# EAGLE design Laser_Array_Temp_High_BRD_V1.1sch (EAGLE 7.7.0)
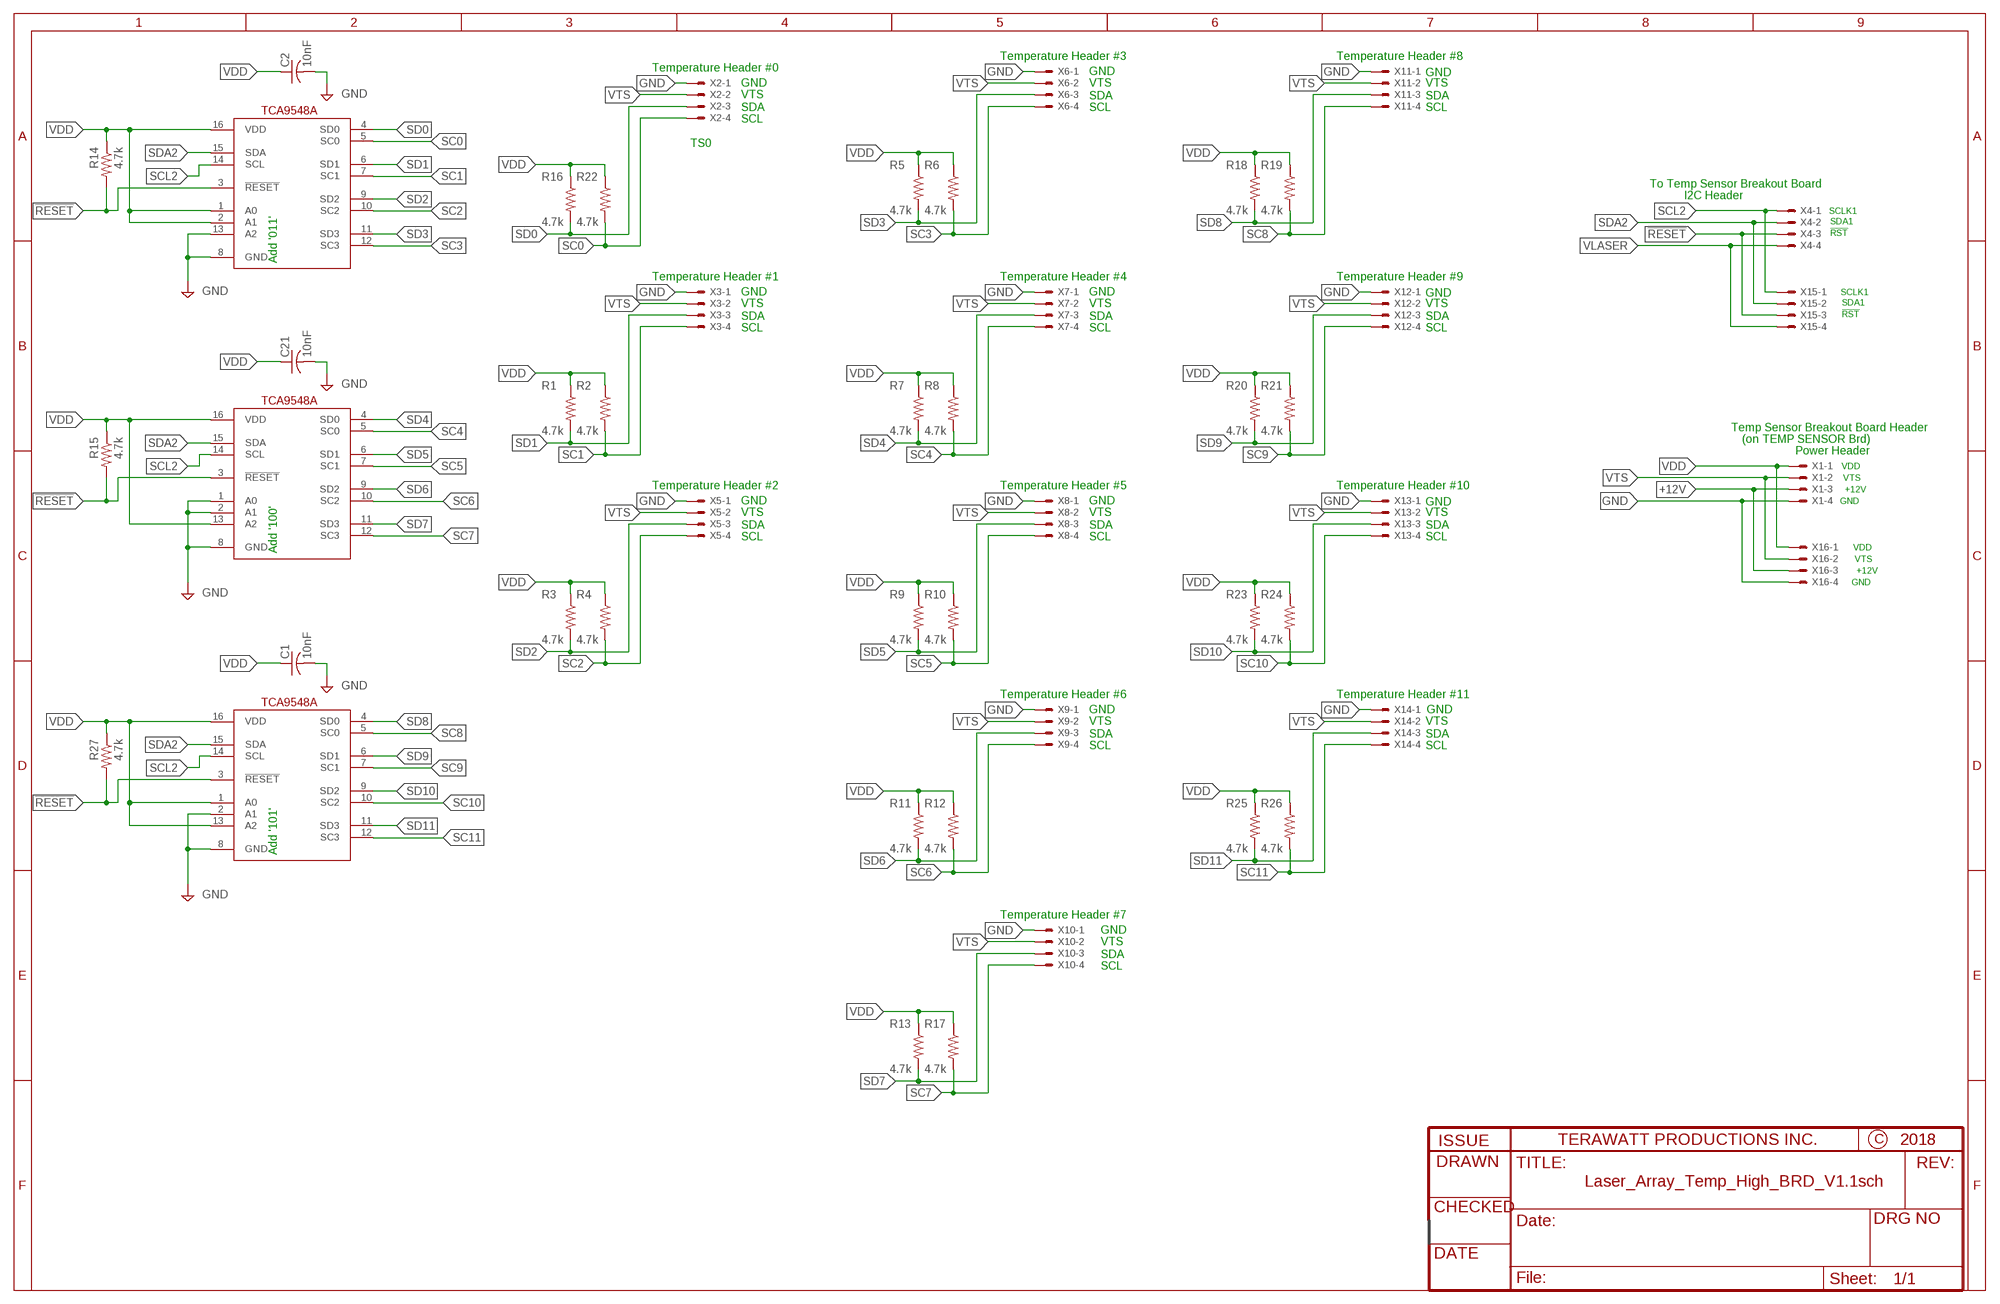
[diagram p0: schematic, sheet 1]

## Parts
C1  10nF  C-USC0805  [C0805]
C2  10nF  C-USC0805  [C0805]
C21  10nF  C-USC0805  [C0805]
R1  4.7k  R-US_M0805  [M0805]
R2  4.7k  R-US_M0805  [M0805]
R3  4.7k  R-US_M0805  [M0805]
R4  4.7k  R-US_M0805  [M0805]
R5  4.7k  R-US_M0805  [M0805]
R6  4.7k  R-US_M0805  [M0805]
R7  4.7k  R-US_M0805  [M0805]
R8  4.7k  R-US_M0805  [M0805]
R9  4.7k  R-US_M0805  [M0805]
R10  4.7k  R-US_M0805  [M0805]
R11  4.7k  R-US_M0805  [M0805]
R12  4.7k  R-US_M0805  [M0805]
R13  4.7k  R-US_M0805  [M0805]
R14  4.7k  R-US_M0805  [M0805]
R15  4.7k  R-US_M0805  [M0805]
R16  4.7k  R-US_M0805  [M0805]
R17  4.7k  R-US_M0805  [M0805]
R18  4.7k  R-US_M0805  [M0805]
R19  4.7k  R-US_M0805  [M0805]
R20  4.7k  R-US_M0805  [M0805]
R21  4.7k  R-US_M0805  [M0805]
R22  4.7k  R-US_M0805  [M0805]
R23  4.7k  R-US_M0805  [M0805]
R24  4.7k  R-US_M0805  [M0805]
R25  4.7k  R-US_M0805  [M0805]
R26  4.7k  R-US_M0805  [M0805]
R27  4.7k  R-US_M0805  [M0805]
U1  TCA9546A  [SOIC16N]
U2  TCA9546A  [SOIC16N]
U3  TCA9546A  [SOIC16N]
X1  22-23-2041  [22-23-2041]
X2  22-23-2041  [22-23-2041]
X3  22-23-2041  [22-23-2041]
X4  22-23-2041  [22-23-2041]
X5  22-23-2041  [22-23-2041]
X6  22-23-2041  [22-23-2041]
X7  22-23-2041  [22-23-2041]
X8  22-23-2041  [22-23-2041]
X9  22-23-2041  [22-23-2041]
X10  22-23-2041  [22-23-2041]
X11  22-23-2041  [22-23-2041]
X12  22-23-2041  [22-23-2041]
X13  22-23-2041  [22-23-2041]
X14  22-23-2041  [22-23-2041]
X15  22-23-2041  [22-23-2041]
X16  22-23-2041  [22-23-2041]

## Nets
!RESET: R14.2 R15.2 R27.2 U1.3(!RESET) U2.3(!RESET) U3.3(!RESET) X4.3 X15.3
+12V: X1.3 X16.3
GND: C1.2 C2.2 C21.2 U1.8(GND) U1.13(A2) U2.1(A0) U2.2(A1) U2.8(GND) U3.2(A1) U3.8(GND) X1.4 X2.1 X3.1 X5.1 X6.1 X7.1 X8.1 X9.1 X10.1 X11.1 X12.1 X13.1 X14.1 X16.4
SC0: R22.2 U1.5(SC0) X2.4
SC1: R2.2 U1.7(SC1) X3.4
SC2: R4.2 U1.10(SC2) X5.4
SC3: R6.2 U1.12(SC3) X6.4
SC4: R8.2 U2.5(SC0) X7.4
SC5: R10.2 U2.7(SC1) X8.4
SC6: R12.2 U2.10(SC2) X9.4
SC7: R17.2 U2.12(SC3) X10.4
SC8: R19.2 U3.5(SC0) X11.4
SC9: R21.2 U3.7(SC1) X12.4
SC10: R24.2 U3.10(SC2) X13.4
SC11: R26.2 U3.12(SC3) X14.4
SCL2: U1.14(SCL) U2.14(SCL) U3.14(SCL) X4.1 X15.1
SD0: R16.2 U1.4(SD0) X2.3
SD1: R1.2 U1.6(SD1) X3.3
SD2: R3.2 U1.9(SD2) X5.3
SD3: R5.2 U1.11(SD3) X6.3
SD4: R7.2 U2.4(SD0) X7.3
SD5: R9.2 U2.6(SD1) X8.3
SD6: R11.2 U2.9(SD2) X9.3
SD7: R13.2 U2.11(SD3) X10.3
SD8: R18.2 U3.4(SD0) X11.3
SD9: R20.2 U3.6(SD1) X12.3
SD10: R23.2 U3.9(SD2) X13.3
SD11: R25.2 U3.11(SD3) X14.3
SDA2: U1.15(SDA) U2.15(SDA) U3.15(SDA) X4.2 X15.2
VDD: C1.1 C2.1 C21.1 R1.1 R2.1 R3.1 R4.1 R5.1 R6.1 R7.1 R8.1 R9.1 R10.1 R11.1 R12.1 R13.1 R14.1 R15.1 R16.1 R17.1 R18.1 R19.1 R20.1 R21.1 R22.1 R23.1 R24.1 R25.1 R26.1 R27.1 U1.1(A0) U1.2(A1) U1.16(VDD) U2.13(A2) U2.16(VDD) U3.1(A0) U3.13(A2) U3.16(VDD) X1.1 X16.1
VLASER: X4.4 X15.4
VTS: X1.2 X2.2 X3.2 X5.2 X6.2 X7.2 X8.2 X9.2 X10.2 X11.2 X12.2 X13.2 X14.2 X16.2

## Notes on the sheet
- Temperature Header #3 | Temperature Header #8
- Temperature Header #0
- GND | GND
- GND | VTS | VTS
- VTS | SDA | SDA
- SDA | SCL | SCL
- SCL
- TS0
- To Temp Sensor Breakout Board
- I2C Header
- SCLK1
- SDA1
- !RST
- Add '011'
- Temperature Header #1 | Temperature Header #4 | Temperature Header #9
- GND | GND | GND | SCLK1
- VTS | VTS | VTS | SDA1
- SDA | SDA | SDA | !RST
- SCL | SCL | SCL
- Temp Sensor Breakout Board Header
- (on TEMP SENSOR Brd)
- Power Header
- VDD
- VTS
- Temperature Header #2 | Temperature Header #5 | Temperature Header #10
- +12V
- GND | GND | GND | GND
- VTS | VTS | VTS
- SDA | SDA | SDA
- SCL | SCL | SCL
- Add '100' | VDD
- VTS
- +12V
- GND
- Temperature Header #6 | Temperature Header #11
- GND | GND
- VTS | VTS
- SDA | SDA
- SCL | SCL
- Add '101'
- Temperature Header #7
- GND
- VTS
- SDA
- SCL

## Library data of the parts
C1 C2 C21 = rcl:C-US: CAPACITOR, American symbol
R1-R27 = rcl:R-US_: RESISTOR, American symbol
U1-U3 = Mine:TCA9546A
X1-X16 = Mine:22-23-2041: .100" (2.54mm) Center Header - 4 Pin; MF: MOLEX; MPN: 22-23-2041; OC_FARNELL: 1462920; OC_NEWARK: 38C0355

## Net classes
0 default: width 0.254 mm, drill 0.508 mm, clearance 0.203 mm

## Board
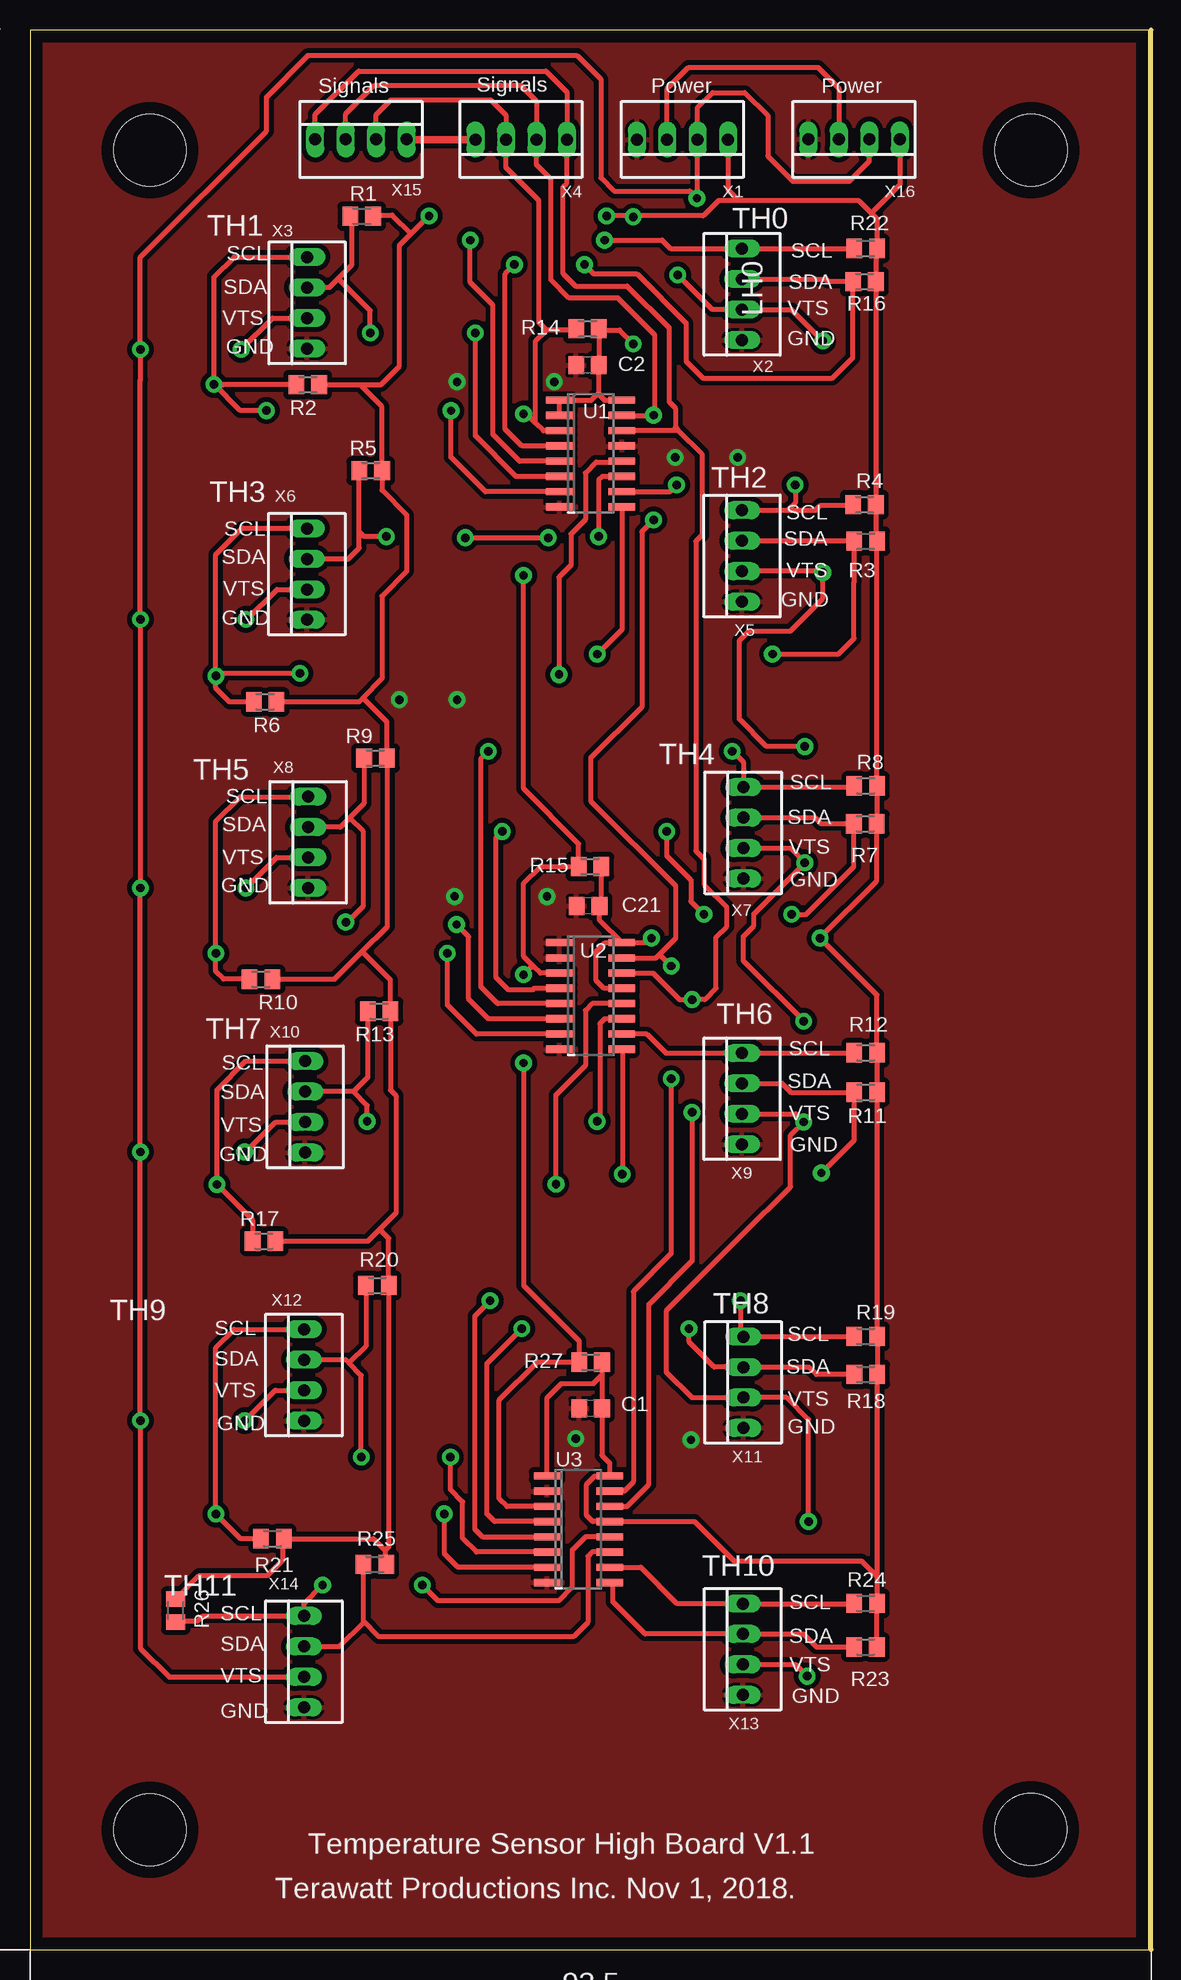
[diagram p1: board, top side]
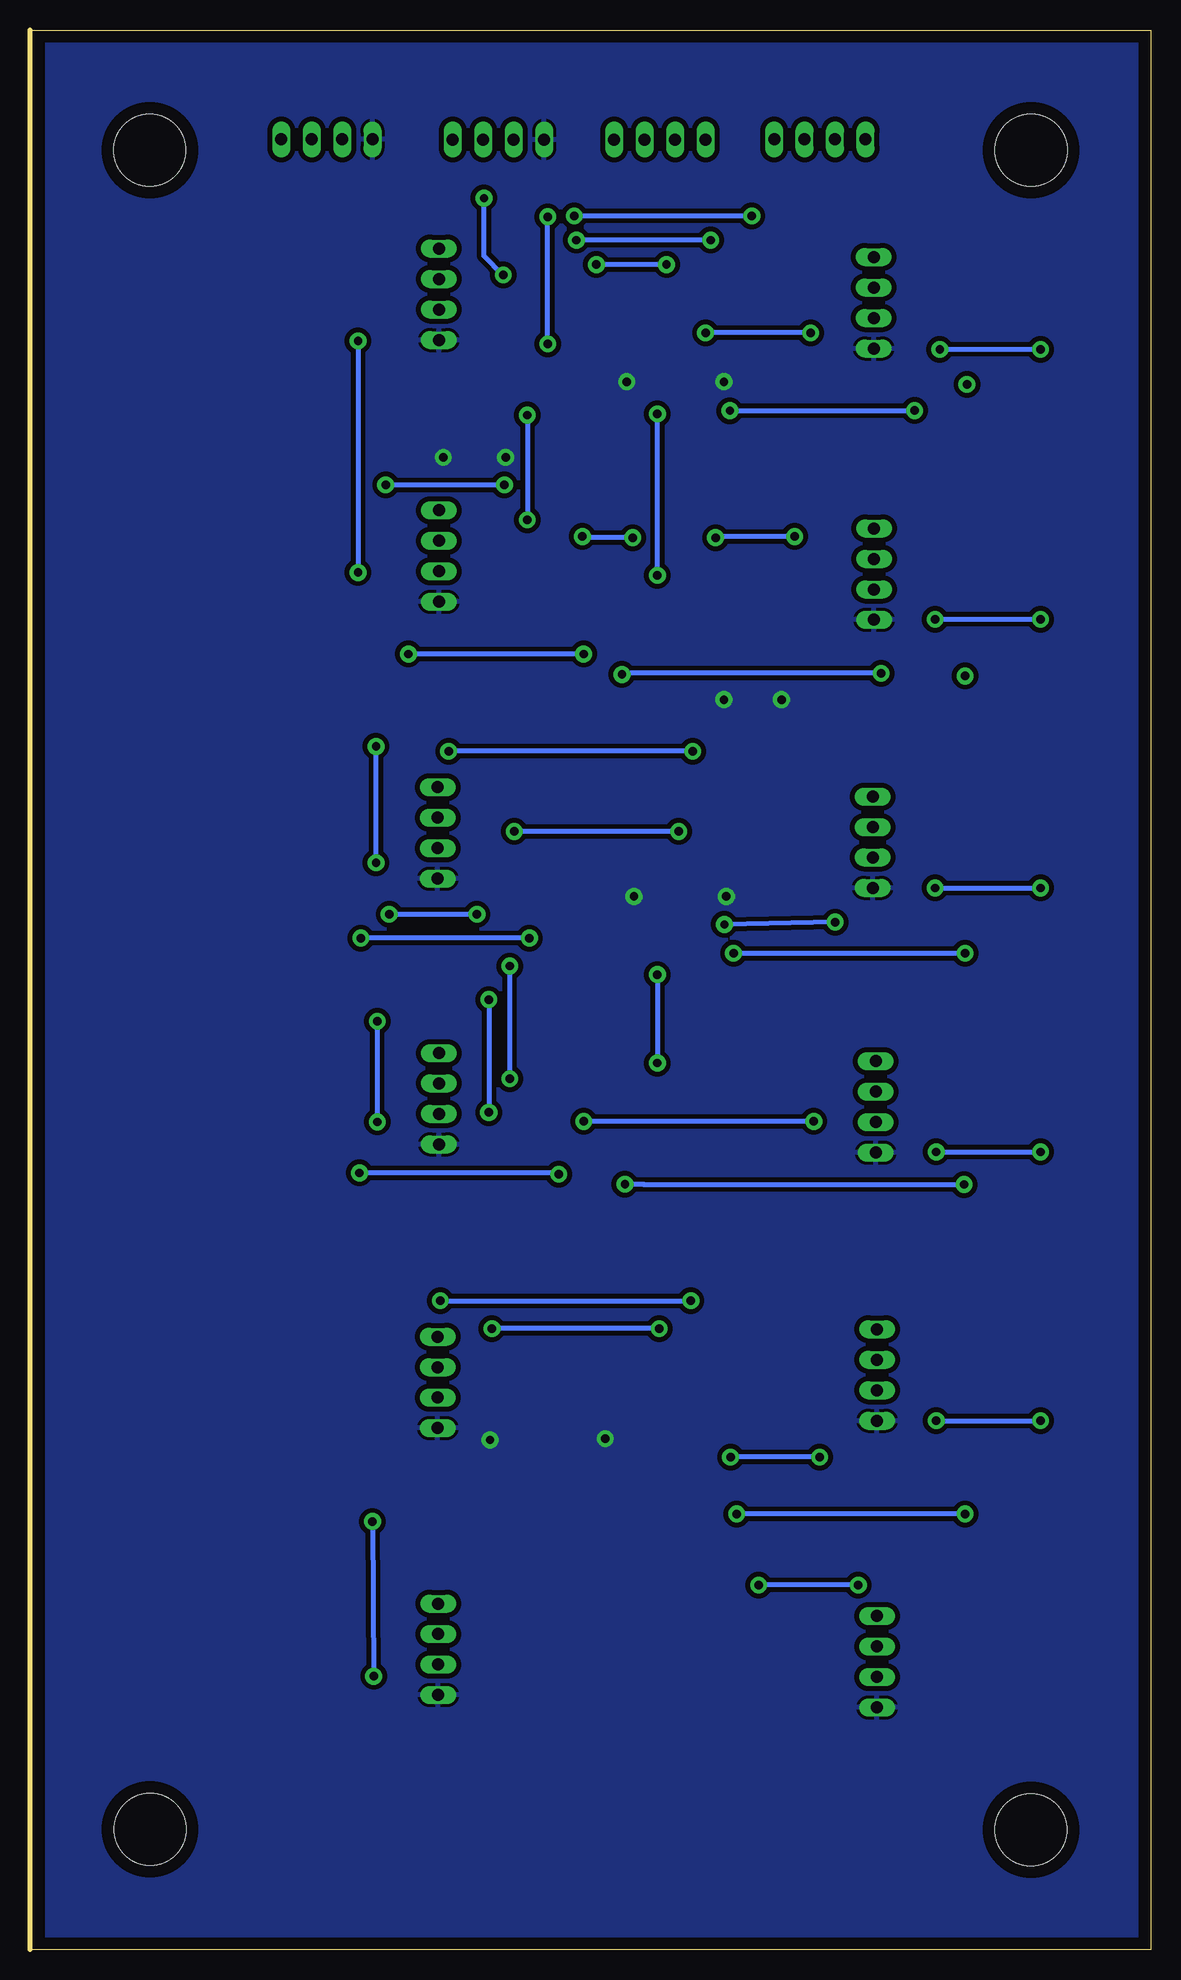
[diagram p2: board, bottom side, seen from below]

Size 93.45 x 160.02 mm. Coordinates in mm from the lower left corner, seen from the top.
Outline: 0,0 93.45,0 93.45,160.02 0,160.02 0,0
Copper layers (1*16): Top 0.035mm / dielectric 1.5mm / Bottom 0.035mm
Design rules "default *": minimum track width 10mil, minimum drill 24mil, track to track 16mil, track to pad 14mil, pad to pad 14mil, via to via 14mil, smd to smd 14mil, copper to edge 40mil, drill to drill 8mil, minimum pad ring 10mil, minimum via ring 8mil, stop-mask expansion 4mil, vias tented up to drill 0mil, thermal gap 10mil
Holes 5.99 mm at 10,10 83.44,10.04 83.46,150
Holes 6 mm at 10,150

### Footprints (pad centres in the part's own frame; a part is rotated, then mirrored left to right if it is on the bottom)
C0805 = smd 1.3 x 1.5: 1 -0.95,0; 2 0.95,0
M0805 = smd 1.3 x 1.6: 1 -0.95,0; 2 0.95,0
SOIC16N = smd 0.6 x 2.2: 1 -4.445,-2.6; 2 -3.175,-2.6; 3 -1.905,-2.6; 4 -0.635,-2.6; 5 0.635,-2.6; 6 1.905,-2.6; 7 3.175,-2.6; 8 4.445,-2.6; 9 4.445,2.6; 10 3.175,2.6; 11 1.905,2.6; 12 0.635,2.6; 13 -0.635,2.6; 14 -1.905,2.6; 15 -3.175,2.6; 16 -4.445,2.6
22-23-2041 = drill 1 long: 1 -3.81,0; 2 -1.27,0; 3 1.27,0; 4 3.81,0

### Placement (x,y rotation side)
C1  46.74,45.13 180 top
C2  46.48,132.08 180 top
C21  46.53,86.99 180 top
R1  27.65,144.51 180 top
R2  23.15,130.46 180 top
R3  69.67,117.41 180 top
R4  69.57,120.46 180 top
R5  28.4,123.28 180 top
R6  19.61,104.01 180 top
R7  69.64,93.86 180 top
R8  69.67,97.02 180 top
R9  28.8,99.33 180 top
R10  19.26,80.9 180 top
R11  69.67,71.47 180 top
R12  69.67,74.77 180 top
R13  29.1,78.23 180 top
R14  46.48,135.13 180 top
R15  46.69,90.3 180 top
R16  69.57,139.04 180 top
R17  19.51,59.06 180 top
R18  69.68,47.95 180 top
R19  69.67,51.12 180 top
R20  28.95,55.38 180 top
R21  20.21,34.26 180 top
R22  69.67,141.81 180 top
R23  69.65,25.23 180 top
R24  69.67,28.87 180 top
R25  28.74,32.13 180 top
R26  12.14,28.27 270 top
R27  46.74,48.98 180 top
U1  46.74,124.71 270 top
U2  46.74,79.5 270 top
U3  45.72,35.05 270 top
X1  54.39,150.89 180 top
X2  59.36,137.98 90 top
X3  23.11,137.29 90 top
X4  40.94,150.89 180 top
X5  59.36,116.18 90 top
X6  23.09,114.66 90 top
X7  59.46,93.09 90 top
X8  23.19,92.31 90 top
X9  59.36,70.94 90 top
X10  22.94,70.26 90 top
X11  59.46,47.29 90 top
X12  22.83,47.91 90 top
X13  59.42,25.04 90 top
X14  22.83,24.01 90 top
X15  27.6,150.9 0 top
X16  68.7,150.9 180 top

### Tracks (layer width: path | path; a pad name or v marks a point on that pad's centre or on a via)
!RESET  (via drill 0.7 pad 1.4)
  Top 0.406: U1.3 42.8,126.62 42.16,127.25 | 42.16,127.25 42.16,134.11 43.05,135 | R14.2 45.41,135 43.05,135 | 42.16,127.25 41.4,128.02 v41.15,128.02 | 43.05,135 42.42,135.64 42.42,145.8 39.67,148.54 39.67,150.1 X4.3 39.67,152.93 38.4,154.2 30.1,154.2 28.87,152.97 X15.3 | U2.3 42.55,81.41 42.04,81.92 | 42.04,81.92 41.15,82.8 41.15,88.9 42.55,90.3 R15.2 45.74,92.18 41.15,96.77 v41.15,114.56 | v41.15,73.91 41.15,55.37 45.79,50.73 R27.2 45.77,49 42.3,49 39.12,45.82 39.12,37.59 39.75,36.96 U3.3 | v41.15,81.28 41.78,81.92 42.04,81.92
  Bottom 0.406: v41.15,114.56 v41.15,128.02 | v41.15,81.28 v41.15,73.91
+12V
  Top 0.406: X1.3 53.12,155.12 54.9,156.9 65.7,156.9 67.43,155.17 X16.3
GND  (via drill 0.7 pad 1.4)
  other vias: 30.8,104.2 35.6,104.2 35.6,130.7 43.7,130.7 35.4,87.8 43.1,87.8 53.8,124.4 59,124.4 45.5,42.6 55.1,42.5
  pour Top: 0,160.1 93.47,159.84 93.47,-0.25 0,0
  pour Bottom: 0,160.1 94.23,159.84 94.23,-0.25 0.25,0
SC0  (via drill 0.7 pad 1.4)
  Top 0.406: U1.5 40.82,124.08 38.6,126.3 38.6,137.1 36.7,139 v36.7,142.5 | R22.2 64.82,141.81 64.8,141.79 X2.4 53.41,141.79 52.7,142.5 v47.9,142.5
  Bottom 0.406: v36.7,142.5 v47.9,142.5
SC1  (via drill 0.7 pad 1.4)
  Top 0.406: U1.7 37.97,121.54 35.1,124.41 v35.1,128.29 | X3.4 17,141.1 15.34,139.44 v15.34,130.49 | R2.2 16.07,130.46 v15.34,130.49 | v19.7,128.3 17.53,128.3 v15.34,130.49
  Bottom 0.406: v35.1,128.29 19.71,128.29 v19.7,128.3
SC2  (via drill 0.7 pad 1.4)
  Top 0.406: X5.4 63.2,119.99 | 63.2,119.99 65.49,119.99 65.9,120.4 68.56,120.4 R4.2 | U1.10 53.34,121.54 v53.9,122.1 | v63.8,122.1 63.8,120.59 63.2,119.99
  Bottom 0.406: v53.9,122.1 v63.8,122.1
SC3  (via drill 0.7 pad 1.4)
  Top 0.406: R6.2 16.64,104.01 15.49,105.16 v15.49,106.17 15.49,106.43 | 15.49,106.43 15.49,116.29 17.7,118.5 23.06,118.5 X6.4 | 15.49,106.43 22.47,106.43 v22.5,106.4 | U1.12 49.26,124 47.2,124 46.3,123.1 46.3,119.2 45.1,118 45.1,115.4 44.1,114.4 v44.1,106.3
  Bottom 0.406: v22.5,106.4 44,106.4 v44.1,106.3
SC4  (via drill 0.7 pad 1.4)
  Top 0.406: U2.5 38.99,78.87 37.59,80.26 37.59,99.28 v38.21,99.9 | R8.2 68.6,96.9 X7.4 59.47,98.98 v58.55,99.9
  Bottom 0.406: v38.21,99.9 v58.55,99.9
SC5  (via drill 0.7 pad 1.4)
  Top 0.406: U2.7 37.21,76.33 34.8,78.74 v34.8,83.06 | R10.2 16.13,80.9 15.49,81.53 v15.49,83.06 15.49,94.09 17.5,96.1 23.17,96.1 X8.4
  Bottom 0.406: v15.49,83.06 v34.8,83.06
SC6
  Top 0.406: U2.10 51.43,76.33 53.01,74.75 X9.4 59.38,74.77 R12.2
SC7  (via drill 0.7 pad 1.4)
  Top 0.406: X10.4 17.97,74.07 15.59,71.69 v15.59,63.79 18.56,60.81 R17.2 | U2.12 46.87,78.87 46.3,78.3 46.3,73.7 43.85,71.25 v43.85,63.81
  Bottom 0.406: 42.29,63.79 42.3,63.8 | 42.29,63.79 43.83,63.79 v43.85,63.81 | 42.29,63.79 v15.59,63.79
SC8  (via drill 0.7 pad 1.4)
  Top 0.406: U3.5 37.72,34.42 37.08,35.05 37.08,52.83 v38.35,54.1 | R19.2 68.7,51.1 X11.4 59.24,51.33 v59.24,54.1
  Bottom 0.406: v59.24,54.1 v38.35,54.1
SC9  (via drill 0.7 pad 1.4)
  Top 0.406: U3.7 35.69,31.88 34.54,33.02 v34.54,36.32 | R21.2 17.55,34.26 v15.49,36.32 15.49,50.19 17.02,51.72 X12.4
  Bottom 0.406: v15.49,36.32 v34.54,36.32
SC10
  Top 0.406: U3.10 50.93,31.88 53.95,28.85 X13.4 68.7,28.85 R24.2
SC11  (via drill 0.7 pad 1.4)
  Top 0.406: U3.12 46.32,34.42 45.2,33.3 45.2,30.2 44.1,29.1 34,29.1 v32.7,30.4 | v24.4,30.4 22.83,28.83 X14.4 14.41,27.82 14.02,27.43 12.25,27.43 R26.2
  Bottom 0.406: v24.4,30.4 v32.7,30.4
SCL2  (via drill 0.7 pad 1.4, 0.7 pad 1.42)
  Top 0.406: 54.08,126.62 U1.14 | U2.14 51.94,81.41 54.15,79.2 v55.2,79.2 56.25,79.2 57.2,80.15 57.2,84.4 58.1,85.3 58.1,86.9 56.2,88.8 56.2,90.9 55.5,91.6 55.5,117.4 56,117.9 56,124.7 54.08,126.62 | 54.08,126.62 53.8,126.9 53.8,128.5 53.3,129 53.3,135.17 49.78,138.68 45.47,138.68 44.45,139.7 44.45,146.95 44.75,147.25 X4.1 44.75,154.85 43,156.6 27.4,156.6 23.79,152.99 X15.1 | U3.14 49.76,36.96 51.6,38.8 51.6,53.8 55.2,57.4 v55.2,69.8
  Bottom 0.406: v55.2,79.2 v55.2,69.8
SD0  (via drill 0.7 pad 1.4)
  Top 0.406: U1.4 41.02,125.35 39.62,126.75 39.62,139.7 v40.39,140.46 | v46.23,140.46 46.99,139.7 50.6,139.7 54.7,135.6 54.7,132.4 56.1,131 66.9,131 68.6,132.7 68.6,139.02 R16.2 68.57,139.1 66.5,139.1 66.35,139.25 X2.3
  Bottom 0.406: v40.39,140.46 v46.23,140.46
SD1  (via drill 0.7 pad 1.4)
  Top 0.406: U1.6 40.51,122.81 37.13,126.19 v37.13,134.77 | 23.05,138.5 X3.3 | R1.2 26.8,144.41 26.8,140.4 25.7,139.3 | 25.7,139.3 24.96,138.56 X3.3 | 23.06,138.6 X3.3 | 25.7,139.3 28.37,136.63 v28.37,134.77
  Bottom 0.406: v28.37,134.77 v37.13,134.77
SD2  (via drill 0.7 pad 1.4)
  Top 0.406: X5.3 68.68,117.45 R3.2 68.72,114.03 68.7,114 68.7,109.3 67.4,108 v61.9,108 | U1.9 49.34,110.04 v47.3,108
  Bottom 0.406: v47.3,108 v61.9,108
SD3  (via drill 0.7 pad 1.4)
  Top 0.406: X6.3 23.12,115.9 26.5,115.9 27.45,116.85 27.45,118.2 | U1.11 47.71,122.81 47.4,122.5 v47.4,117.8 | 27.45,118.2 R5.2 | v29.7,117.8 27.85,117.8 27.45,118.2 | v36.3,117.7 v43.2,117.7
  Bottom 0.406: v29.7,117.8 36.2,117.8 v36.3,117.7 | v43.2,117.7 47.3,117.7 v47.4,117.8
SD4  (via drill 0.7 pad 1.4)
  Top 0.406: U2.4 42.04,80.14 41.91,80.01 39.88,80.01 38.86,81.03 38.86,92.71 v39.37,93.22 | v53.09,93.22 53.09,91.19 55.12,89.15 55.1,89.14 55.1,87.39 v56.19,86.3 | X7.3 65.44,94.36 65.94,93.86 R7.2 68.69,90.29 64.7,86.3 v63.5,86.3
  Bottom 0.406: v39.37,93.22 v53.09,93.22 | v56.19,86.3 v63.5,86.3
SD5  (via drill 0.7 pad 1.4)
  Top 0.406: U2.6 38.23,77.6 36.58,79.25 36.58,84.44 v35.56,85.46 | R9.2 27.85,95.55 26.65,94.35 | 26.65,94.35 25.88,93.58 X8.3 | v26.32,85.66 26.26,85.46 27.8,87 27.8,93.2 26.65,94.35
  Bottom 0.406: v26.32,85.66 v35.56,85.46
SD6  (via drill 0.7 pad 1.4)
  Top 0.406: X9.3 62.69,72.21 63.42,71.47 R11.2 68.72,67.49 v65.98,64.75 | U2.9 49.38,75.02 v49.38,64.65
  Bottom 0.406: v49.38,64.65 49.48,64.75 v65.98,64.75
SD7  (via drill 0.7 pad 1.4)
  Top 0.406: 26.97,71.53 28.11,70.39 v28.11,69.05 | 26.97,71.53 X10.3 | R13.2 28.15,72.71 26.97,71.53 | U2.11 47.9,77.6 47.5,77.2 47.5,69.27 v47.28,69.05
  Bottom 0.406: v28.11,69.05 v47.28,69.05
SD8  (via drill 0.7 pad 1.4)
  Top 0.406: U3.4 38.73,35.69 38.1,36.32 38.1,48.87 v41,51.78 | R18.2 65.55,47.95 64.94,48.56 X11.3 59.45,48.58 57.04,48.58 54.94,50.68 v54.94,51.78
  Bottom 0.406: v41,51.78 v54.94,51.78
SD9  (via drill 0.7 pad 1.4)
  Top 0.406: U3.6 37.21,33.15 36.07,34.29 36.07,37.34 35.05,38.35 v35.05,41.06 | v27.62,41.06 27.62,47.88 26.6,48.9 | 26.6,48.9 26.32,49.18 X12.3 | R20.2 28,50.3 26.6,48.9
  Bottom 0.406: v27.62,41.06 v35.05,41.06
SD10
  Top 0.406: U3.9 48.6,30.33 48.6,29 51.29,26.31 X13.3 64.49,26.31 65.57,25.23 R23.2
SD11
  Top 0.406: X14.3 25.78,25.28 27.79,27.29 27.79,27.4 | 27.79,27.4 R25.2 | U3.11 46.85,33.15 46.5,32.8 46.5,27.3 45.3,26.1 29.09,26.1 27.79,27.4
SDA2  (via drill 0.7 pad 1.4)
  Top 0.406: U3.15 49.53,38.23 50.29,38.99 50.29,54.86 53.46,58.03 v53.46,72.6 | U1.15 51.96,127.89 v51.99,127.92 52.07,128 52.07,134.62 49.02,137.67 44.96,137.67 43.43,139.19 43.43,147.57 42.21,148.8 42.21,150.1 X4.2 42.21,154.09 40.9,155.4 28.7,155.4 26.33,153.03 X15.2 | U2.15 52.2,82.68 52.41,82.89 | 52.41,82.89 53.85,84.33 53.85,88.65 46.74,95.76 46.74,99.31 51,103.58 51,118.19 v51.99,119.18 | v53.46,82 52.56,82.89 52.41,82.89
  Bottom 0.406: v51.99,127.92 v51.99,119.18 | v53.46,82 v53.46,72.6
VDD  (via drill 0.7 pad 1.4)
  Top 0.406: U1.16 47.88,129.16 47.43,129.61 47.43,129.8 | 50.29,144.53 v48.07,144.53 | v50.29,133.86 49.15,135 47.56,135 R14.1 C2.1 47.43,129.8 | v50.29,144.45 50.29,144.53 | 50.29,144.53 56.13,144.53 57.4,145.8 59.1,145.8 | U2.16 47.48,85.8 C21.1 47.64,87.15 R15.1 | U2.16 51.44,83.95 v51.82,84.33 | 21.21,59.06 R17.1 28.16,59.06 29.15,60.05 | 31.77,143.03 30.77,142.03 30.8,142 30.8,132 29.26,130.46 27.5,130.46 | 31.77,143.03 v33.27,144.53 | R1.1 28.7,144.6 30.2,144.6 31.77,143.03 | R2.1 27.5,130.46 | R6.1 27.41,104.01 27.75,104.35 | 27.75,104.35 29.35,105.95 29.35,112.85 31.4,114.9 31.4,119.6 29.35,121.65 R5.1 29.35,128.61 27.5,130.46 | R10.1 25.4,80.9 27.7,83.2 | 27.7,83.2 29.8,85.3 29.8,99.29 R9.1 29.75,102.35 27.75,104.35 | 29.15,60.05 30.5,61.4 30.5,71.2 30.05,71.65 R13.1 30.05,80.85 27.7,83.2 | 29.15,60.05 29.9,59.3 R20.1 29.9,33.6 29.6,33.3 | 21.08,34.34 R21.1 | U1.2 U1.1 46.79,129.16 47.43,129.8 | U2.13 47.86,80.14 47.2,80.8 47.2,83.2 47.95,83.95 U2.16 | R25.1 29.6,32.22 29.6,33.3 | R21.1 28.64,34.26 29.6,33.3 | 59.1,145.8 69.1,145.8 70.15,144.75 | 70.15,144.75 70.6,144.3 70.6,141.83 R22.1 70.53,141.72 R16.1 R4.1 70.52,117.52 R3.1 | R3.1 70.88,117.15 | R3.1 R8.1 70.59,96.98 R7.1 70.6,93.84 70.6,89.1 65.83,84.33 v65.87,84.33 70.62,79.58 R12.1 R11.1 R19.1 70.63,51.1 R18.1 70.63,31.1 | R23.1 70.62,25.25 R24.1 70.63,28.89 70.63,31.1 | R21.1 21.1,34.2 21.1,32.5 19.8,31.2 15.85,31.2 14.4,31.2 14.12,31.2 R26.1 | R27.1 47.69,47.9 | 47.69,47.9 C1.1 47.69,41.21 48.32,40.58 U3.16 47.1,39.5 46.4,38.8 46.4,36.2 46.91,35.69 U3.13 55.41,35.69 58.7,32.4 69.33,32.4 70.63,31.1 | U3.1 43.12,46.02 44.3,47.2 46.99,47.2 47.69,47.9
  Top 0.406: X1.1 58.2,146.69 59.1,145.8 | X16.1 72.51,147.11 70.15,144.75
  Bottom 0.406: v48.07,144.53 v33.27,144.53 | v50.29,133.86 v50.29,144.45 | v51.82,84.33 v65.87,84.33
VLASER
  Top 0.61: X15.4 X4.4
VTS  (via drill 0.7 pad 1.4)
  Top 0.406: v18,110.9 18.05,110.85 20.59,113.39 X6.2 | v17.9,66.5 17.95,66.45 20.49,68.99 X10.2 | v17.9,44.1 20.44,46.64 X12.2 | v64.6,100.3 61.4,100.3 59.13,102.57 59.13,109.12 59.94,109.93 63.4,109.93 66.1,112.63 v66.1,114.8 65.99,114.91 X5.2 | v64.5,77.4 59.47,82.44 59.47,84.46 60.35,85.34 60.35,86.35 v64.6,90.6 63.38,91.82 X7.2 | X16.2 69.97,149.07 68.3,147.4 63.6,147.4 61.5,149.5 61.5,152.9 59.6,154.8 56.9,154.8 55.66,153.56 X1.2 55.66,146 v55.6,146 55,146.6 48.7,146.6 47.6,147.7 47.6,155.9 45.6,157.9 23.18,157.9 19.71,154.43 19.71,151.6 9.2,141.09 v9.2,133.4 9.2,130.91 9.22,130.89 9.2,130.87 v9.2,110.9 v9.2,88.5 v9.2,66.5 v9.2,44.1 9.2,25.14 11.6,22.74 X14.2 | v66.1,134.1 63.49,136.71 X2.2 56.89,136.71 v54,139.6 | v17.6,133.4 20.22,136.02 X3.2 | v18,88.5 20.54,91.04 X8.2 | X9.2 63.83,69.67 v64.5,69 63.4,67.9 63.4,63.6 59.37,59.57 59.37,59.56 53.03,53.23 53.03,48.16 55.17,46.02 X11.2 63.1,46.02 64.9,44.22 v64.9,35.7 | X13.2 63.83,23.77 v64.8,22.8
  Bottom 0.406: v17.6,133.4 v9.2,133.4 | v18,110.9 v9.2,110.9 | v18,88.5 v9.2,88.5 | v17.9,66.5 v9.2,66.5 | v17.9,44.1 v9.2,44.1 | v54,139.6 55.6,141.2 v55.6,146 | v66.1,134.1 v66.1,114.8 | v64.6,90.6 v64.6,100.3 | v64.5,77.4 v64.5,69 | v64.9,35.7 v64.8,22.8

### Text on the board
tPlace: Signals | Signals | Power | Power | TH1 | TH0 | SCL | SCL | SDA | SDA | LH0 | VTS | VTS | GND | GND | TH2 | TH3 | SCL | SCL | SDA | SDA | VTS | VTS | GND | GND | TH4 | TH5 | SCL | SCL | SDA | SDA | VTS | VTS | GND | GND | TH6 | TH7 | SCL | SCL | SDA | SDA | VTS | VTS | GND | GND | TH8 | TH9 | SCL | SCL | SDA | SDA | VTS | VTS | GND | GND | TH10 | TH11 | SCL | SCL | SDA | SDA | VTS | VTS | GND | GND | Temperature Sensor High Board V1.1 | Terawatt Productions Inc. Nov 1, 2018.